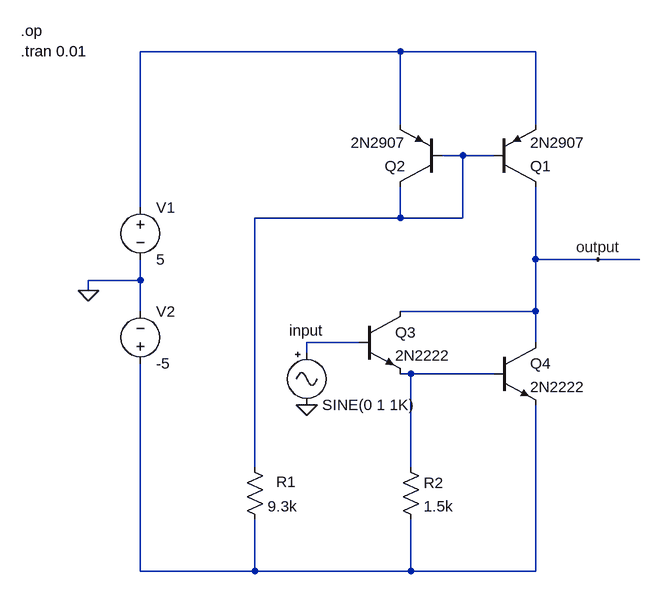
[diagram p0: schematic block2.asc]
block2.asc, the LTspice schematic file:
Version 4
SHEET 1 880 680
WIRE 496 -320 96 -320
WIRE 704 -320 496 -320
WIRE 496 -208 496 -320
WIRE 704 -208 704 -320
WIRE 592 -160 560 -160
WIRE 640 -160 592 -160
WIRE 96 -80 96 -320
WIRE 496 -64 496 -112
WIRE 496 -64 272 -64
WIRE 592 -64 592 -160
WIRE 592 -64 496 -64
WIRE 704 0 704 -112
WIRE 800 0 704 0
WIRE 864 0 800 0
WIRE 96 32 96 0
WIRE 96 32 16 32
WIRE 16 48 16 32
WIRE 96 80 96 32
WIRE 704 80 704 0
WIRE 704 80 496 80
WIRE 432 128 352 128
WIRE 704 128 704 80
WIRE 352 144 352 128
WIRE 512 176 496 176
WIRE 640 176 512 176
WIRE 272 320 272 -64
WIRE 512 320 512 176
WIRE 96 480 96 160
WIRE 272 480 272 400
WIRE 272 480 96 480
WIRE 512 480 512 400
WIRE 512 480 272 480
WIRE 704 480 704 224
WIRE 704 480 512 480
FLAG 16 48 0
FLAG 352 224 0
FLAG 800 0 output
SYMBOL voltage 96 -96 R0
SYMATTR InstName V1
SYMATTR Value 5
SYMBOL pnp 640 -112 M180
SYMATTR InstName Q1
SYMATTR Value 2N2907
SYMBOL pnp 560 -112 R180
SYMATTR InstName Q2
SYMATTR Value 2N2907
SYMBOL npn 432 80 R0
SYMATTR InstName Q3
SYMATTR Value 2N2222
SYMBOL npn 640 128 R0
SYMATTR InstName Q4
SYMATTR Value 2N2222
SYMBOL res 256 304 R0
WINDOW 0 49 38 Left 2
SYMATTR InstName R1
SYMATTR Value 9.3k
SYMBOL res 496 304 R0
SYMATTR InstName R2
SYMATTR Value 1.5k
SYMBOL voltage 96 176 M180
WINDOW 0 24 96 Left 2
WINDOW 3 24 16 Left 2
SYMATTR InstName V2
SYMATTR Value -5
SYMBOL Misc/signal 352 128 R0
WINDOW 0 -27 -19 Left 2
SYMATTR InstName input
TEXT -88 -352 Left 2 !.op\n.tran 0.01

The netlist it stands for:
* block2.asc
V1 N001 0 5
Q1 output N002 N001 0 2N2907
Q2 N002 N002 N001 0 2N2907
Q3 output N003 N004 0 2N2222
Q4 output N004 N005 0 2N2222
R1 N002 N005 9.3k
R2 N004 N005 1.5k
V2 N005 0 -5
V§input N003 0 SINE(0 1 1K)
.model NPN NPN
.model PNP PNP
.lib standard.bjt
.op
.tran 0.01
.backanno
.end